# EAGLE design temperature (EAGLE 7.7.0)
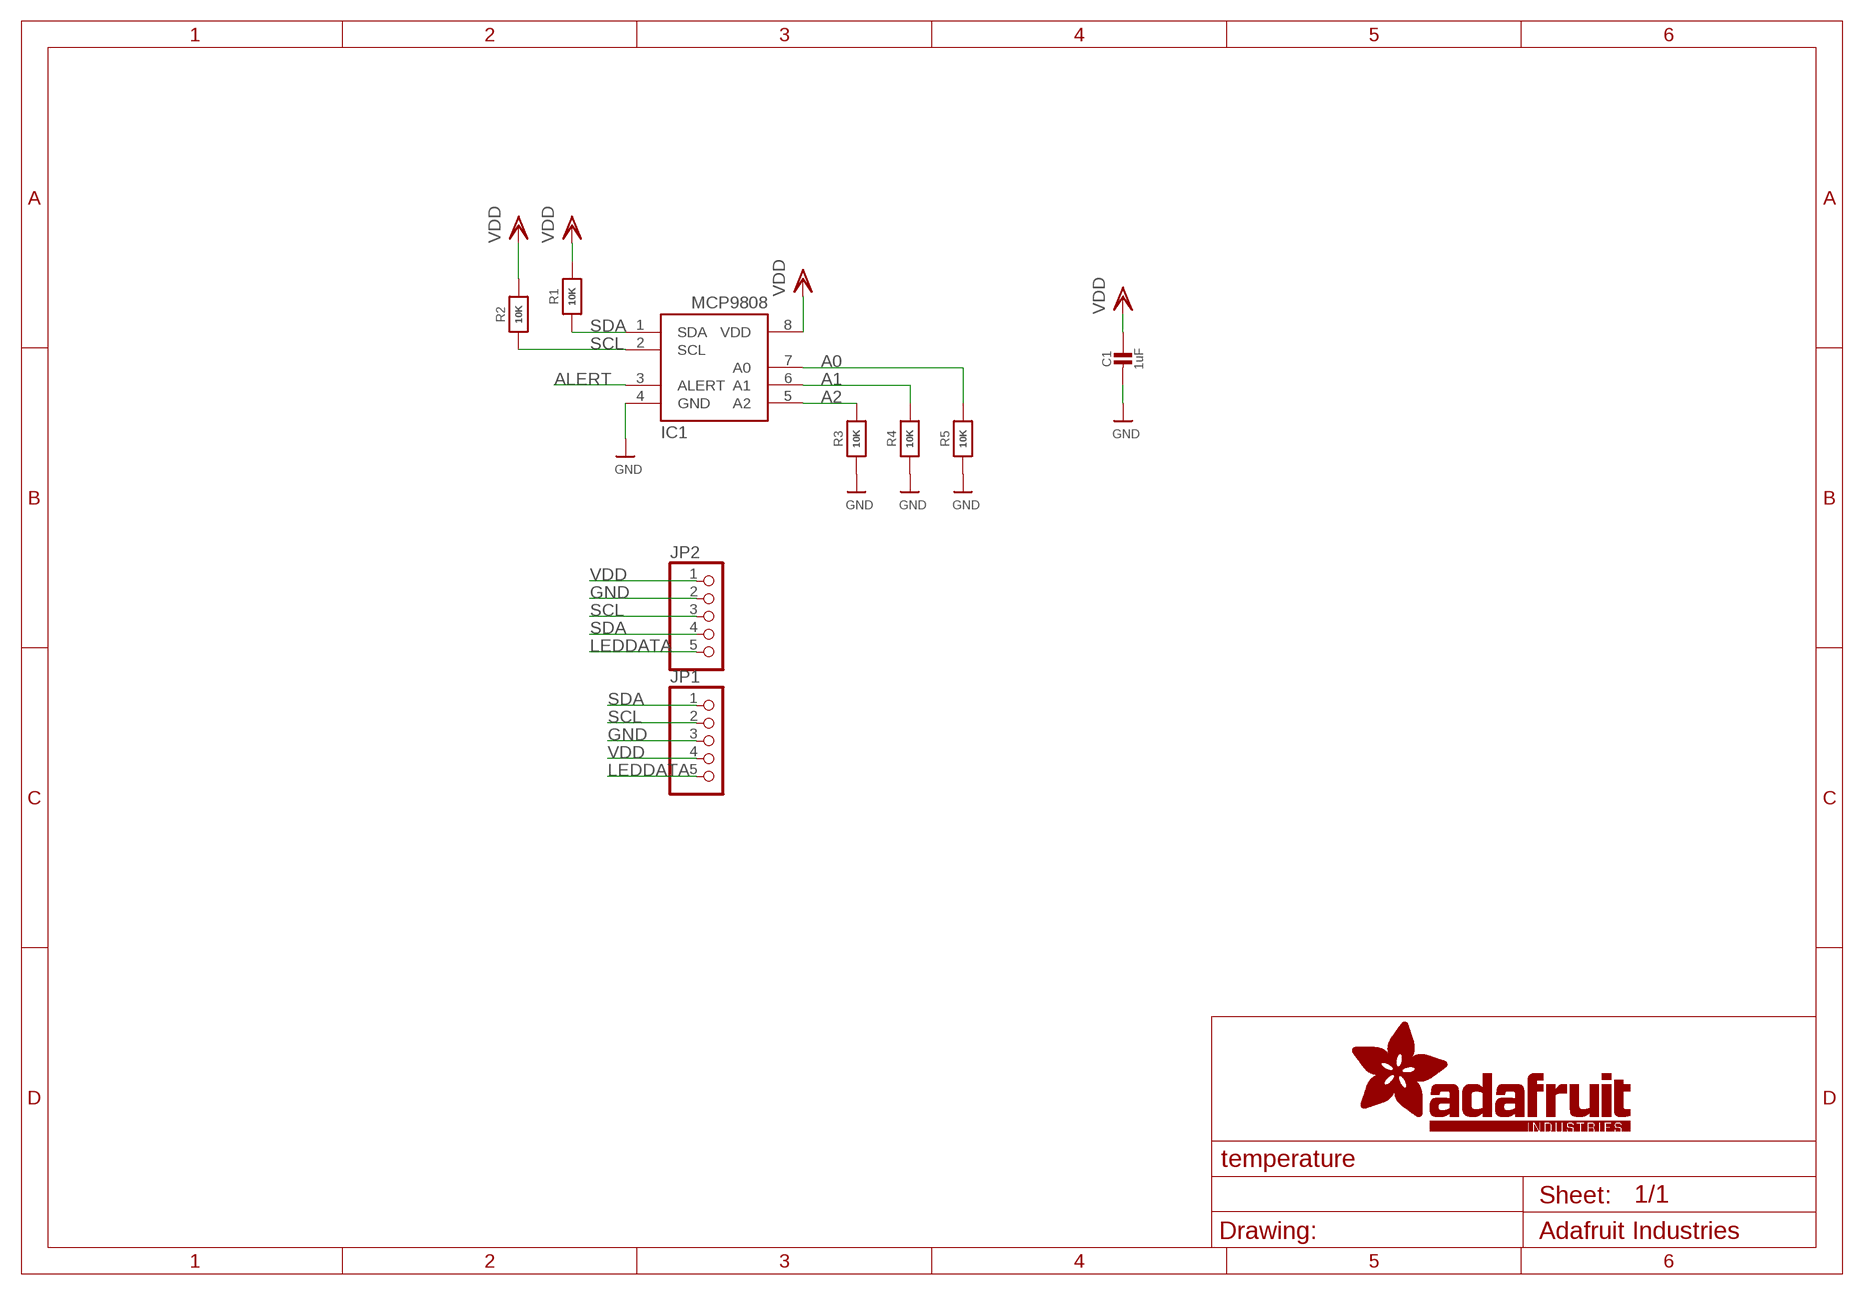
[diagram p0: schematic, sheet 1]

## Parts
C1  1uF  CAP_CERAMIC_0805MP  [_0805MP]
IC1  MCP9808-E/MS  [MSOP8_0.65MM]
JP1  PINHD-1X55X2MM  [1_05X2MM]
JP2  PINHD-1X55X2MM  [1_05X2MM]
R1  10K  RESISTOR0805_NOOUTLINE  [0805-NO]
R2  10K  RESISTOR0805_NOOUTLINE  [0805-NO]
R3  10K  RESISTOR0805_NOOUTLINE  [0805-NO]
R4  10K  RESISTOR0805_NOOUTLINE  [0805-NO]
R5  10K  RESISTOR0805_NOOUTLINE  [0805-NO]

## Nets
A0: IC1.7(A0) R5.2
A1: IC1.6(A1) R4.2
A2: IC1.5(A2) R3.2
ALERT: IC1.3(ALERT)
GND: C1.2 IC1.4(GND) JP1.3 JP2.2 R3.1 R4.1 R5.1
LEDDATA: JP1.5 JP2.5
SCL: IC1.2(SCL) JP1.2 JP2.3 R2.1
SDA: IC1.1(SDA) JP1.1 JP2.4 R1.1
VDD: C1.1 IC1.8(VDD) JP1.4 JP2.1 R1.2 R2.2

## Library data of the parts
C1 = microbuilder:CAP_CERAMIC: Ceramic Capacitors For new designs, use the packages preceded by an '_' character since they are more reliable: The following footprints should be used on most boards: _0402 - Standard footprint for regular board layouts _0603 - Standard footprint for regular board layouts _0805 - Standard footprint for regular board layouts _1206 - Standard footprint for regular board layouts For extremely tight-pitch boards where space is at a premium, the following 'micro-pitch' footprints can be used (smaller pads, no silkscreen outline, etc.): _0402MP - Micro-pitch footprint for very dense/compact boards _0603MP - Micro-pitch footprint for very dense/compact boards _0805MP - Micro-pitch footprint for very dense/compact boards _1206MP - Micro-pitch footprint for very dense/compact boards
IC1 = microbuilder:MCP9808
JP1 JP2 = pinhead:PINHD-1X5: PIN HEADER
R1-R5 = microbuilder:RESISTOR: Resistors For new designs, use the packages preceded by an '_' character since they are more reliable: The following footprints should be used on most boards: _0402 - Standard footprint for regular board layouts _0603 - Standard footprint for regular board layouts _0805 - Standard footprint for regular board layouts _1206 - Standard footprint for regular board layouts For extremely tight-pitch boards where space is at a premium, the following 'micro-pitch' footprints can be used (smaller pads, no silkscreen outline, etc.): _0402MP - Micro-pitch footprint for very dense/compact boards _0603MP - Micro-pitch footprint for very dense/compact boards _0805MP - Micro-pitch footprint for very dense/compact boards _1206MP - Micro-pitch footprint for very dense/compact boards

## Board
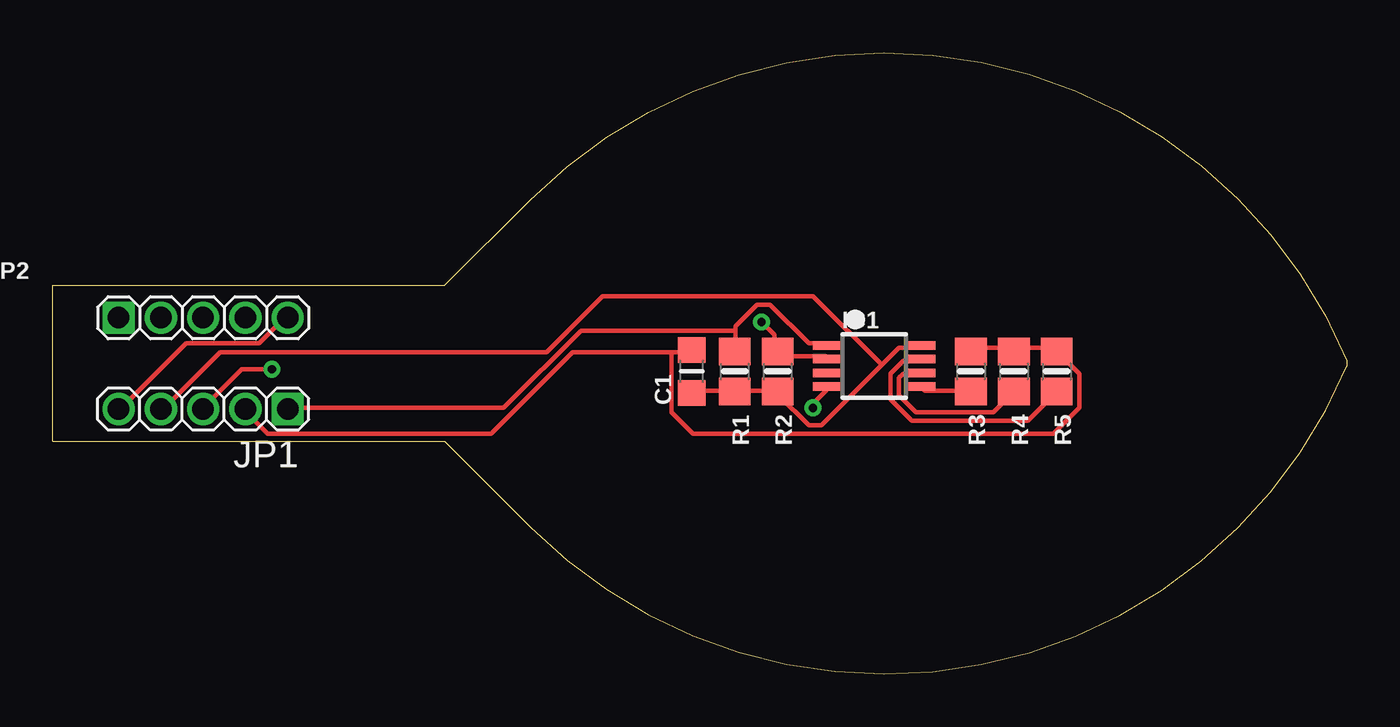
[diagram p1: board, top side]
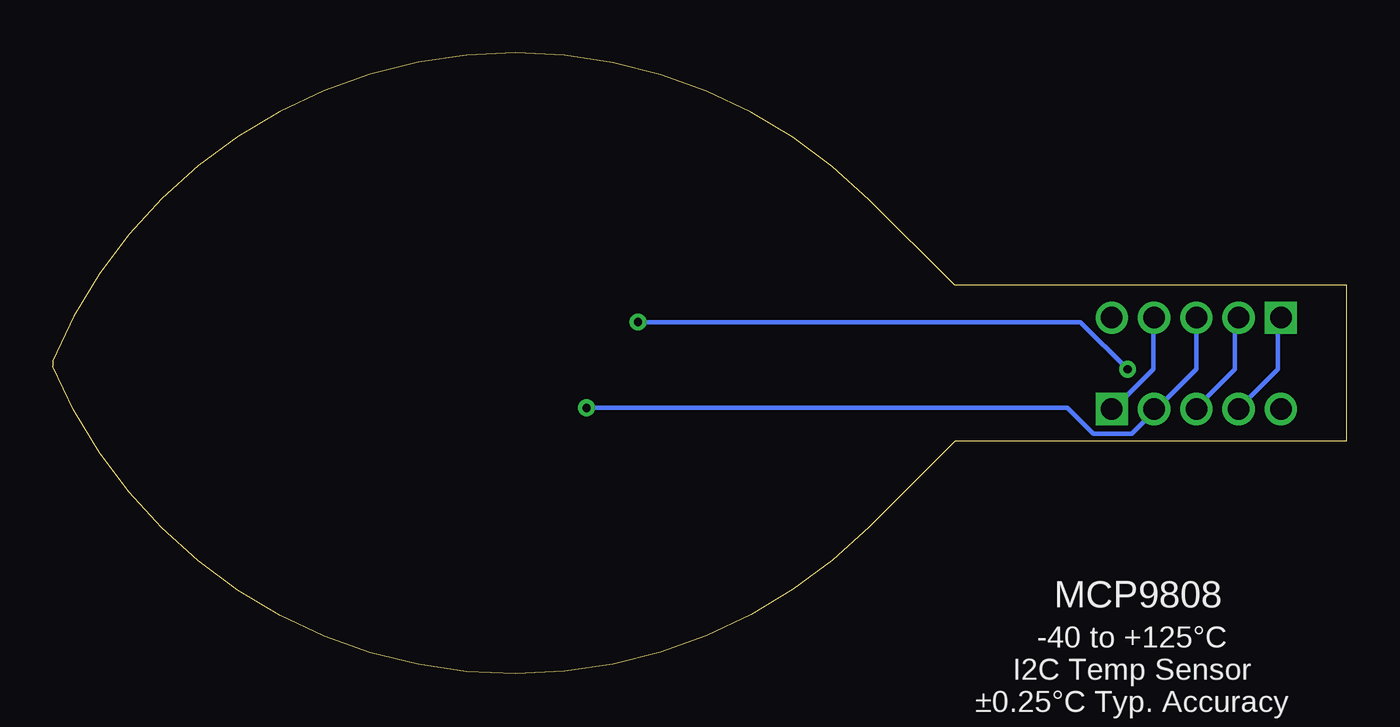
[diagram p2: board, bottom side, seen from below]

Size 61.21 x 29.37 mm. Coordinates in mm from the lower left corner, seen from the top.
Outline: 0,11 18.54,11 22.61,6.94 arc112 61.21,14.56 61.21,14.81 arc112 22.61,22.43 18.54,18.37 0,18.37 0,11
Copper layers (1*16): Top 0.035mm / dielectric 1.5mm / Bottom 0.035mm
Design rules "adafruit": minimum track width 8mil, minimum drill 15.5mil, track to track 8mil, track to pad 8mil, pad to pad 8mil, via to via 8mil, smd to smd 8mil, copper to edge 10mil, drill to drill 8mil, minimum pad ring 10mil, minimum via ring 8mil, stop-mask expansion 2mil, vias tented up to drill 20mil, thermal gap 10mil

### Footprints (pad centres in the part's own frame; a part is rotated, then mirrored left to right if it is on the bottom)
_0805MP = smd 1.2 x 1.3: 1 -1.016,0; 2 1.016,0
MSOP8_0.65MM = smd 0.4 x 1.4: 1 -0.975,-2.2; 2 -0.325,-2.2; 3 0.325,-2.2; 4 0.975,-2.2; 5 0.975,2.2; 6 0.325,2.2; 7 -0.325,2.2; 8 -0.975,2.2
1_05X2MM = drill 1.016 pad 1.3 square: 1 -4,0 | drill 1.016 pad 1.3: 2 0,0; 3 -2,0; 4 2,0; 5 4,0
0805-NO = smd 1.3 x 1.5: 1 -0.95,0; 2 0.95,0

### Placement (x,y rotation side)
C1  30.23,14.3 90 top
IC1  38.86,14.56 270 top
JP1  7.11,12.53 180 top
JP2  7.11,16.84 0 top
R1  32.26,14.3 270 top
R2  34.29,14.3 270 top
R3  43.43,14.3 270 top
R4  45.47,14.3 270 top
R5  47.5,14.3 270 top

### Tracks (layer width: path | path; a pad name or v marks a point on that pad's centre or on a via)
A0
  Top 0.203: IC1.7 41.05,14.81 40.23,14.81 39.62,14.2 39.62,12.98 40.64,11.97 46.13,11.97 47.35,13.19 R5.2
A1
  Top 0.203: IC1.6 41.05,14.2 40.23,14.2 40.03,14 40.03,13.19 40.84,12.37 44.5,12.37 45.31,13.19 R4.2
A2
  Top 0.203: IC1.5 41.25,13.39 43.28,13.39 R3.2
GND  (via drill 0.39)
  Top 0.203: R3.1 43.48,15.42 45.31,15.42 R4.1 45.52,15.42 47.35,15.42 R5.1 47.55,15.22 48.56,14.2 48.56,12.58 47.35,11.36 30.28,11.36 29.26,12.37 29.26,15.22 | 29.26,15.22 24.59,15.22 20.73,11.36 10.16,11.36 9.14,12.37 JP1.3 | 29.26,15.22 30.07,15.22 C1.2 | v35.97,12.58 35.97,12.78 36.58,13.39 IC1.4
  Bottom 0.203: v35.97,12.58 13.21,12.58 11.99,11.36 10.16,11.36 9.14,12.37 JP1.3 8.94,12.58 7.11,14.41 JP2.2
LEDDATA
  Top 0.203: JP1.5 3.25,12.58 6.3,15.63 9.75,15.63 10.97,16.84 JP2.5
SCL  (via drill 0.39)
  Top 0.203: IC1.2 36.58,15.02 34.54,15.02 34.34,15.22 R2.1 34.14,15.42 34.14,16.03 v33.53,16.64 | v10.36,14.41 8.94,14.41 7.11,12.58 JP1.2
  Bottom 0.203: v33.53,16.64 12.6,16.64 v10.36,14.41 | JP2.3 5.28,16.84 5.28,14.41 7.11,12.58 JP1.2
SDA
  Top 0.203: 32.31,16.23 32.31,15.42 R1.1 | 32.31,16.23 32.31,16.44 33.33,17.45 33.93,17.45 35.76,15.63 36.58,15.63 IC1.1 | 32.31,16.23 24.99,16.23 21.34,12.58 11.18,12.58 JP1.1
  Bottom 0.203: JP2.4 9.14,16.84 9.14,14.41 10.97,12.58 JP1.1
VDD
  Top 0.203: C1.1 30.28,13.39 32.11,13.39 R1.2 32.31,13.39 34.14,13.39 R2.2 34.34,13.19 35.76,11.76 36.37,11.76 39.22,14.61 | 39.22,14.61 40.03,15.42 41.05,15.42 IC1.8 | 39.22,14.61 35.97,17.86 26.01,17.86 23.37,15.22 7.92,15.22 5.28,12.58 JP1.4
  Bottom 0.203: JP2.1 3.25,16.84 3.25,14.41 5.08,12.58 JP1.4

### Text on the board
bPlace: MCP9808 | -40 to +125°C | I2C Temp Sensor | ±0.25°C Typ. Accuracy | Vdd & Logic: 2.7-5.5V